# Altium schematic sheet Sheet_1_nizovie.SchDoc
size A4
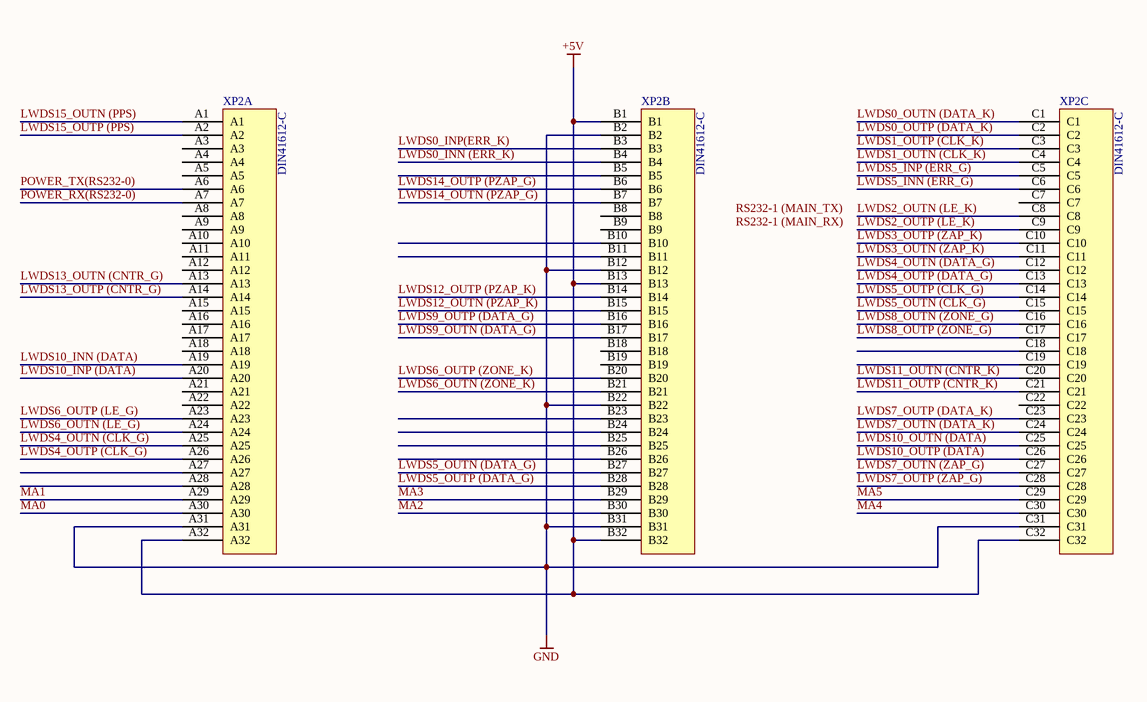
[diagram p0: Sheet_1_nizovie.SchDoc]

## Parts
XP2  DIN41612-C  [DIN41612C]  (parts A,B,C of 3)

## Nets
+5V: XP2.A32 XP2.B1 XP2.B13 XP2.B32 XP2.C32
GND: XP2.A31 XP2.B2 XP2.B12 XP2.B22 XP2.B31 XP2.C31
LWDS0_INN (ERR_K): XP2.B4
LWDS0_INP(ERR_K): XP2.B3
LWDS0_OUTN (DATA_K): XP2.C1
LWDS0_OUTP (DATA_K): XP2.C2
LWDS1_OUTN (CLK_K): XP2.C4
LWDS1_OUTP (CLK_K): XP2.C3
LWDS2_OUTN (LE_K): XP2.C8
LWDS2_OUTP (LE_K): XP2.C9
LWDS3_OUTN (ZAP_K): XP2.C11
LWDS3_OUTP (ZAP_K): XP2.C10
LWDS4_OUTN (CLK_G): XP2.A25
LWDS4_OUTN (DATA_G): XP2.C12
LWDS4_OUTP (CLK_G): XP2.A26
LWDS4_OUTP (DATA_G): XP2.C13
LWDS5_INN (ERR_G): XP2.C6
LWDS5_INP (ERR_G): XP2.C5
LWDS5_OUTN (CLK_G): XP2.C15
LWDS5_OUTN (DATA_G): XP2.B27
LWDS5_OUTP (CLK_G): XP2.C14
LWDS5_OUTP (DATA_G): XP2.B28
LWDS6_OUTN (LE_G): XP2.A24
LWDS6_OUTN (ZONE_K): XP2.B21
LWDS6_OUTP (LE_G): XP2.A23
LWDS6_OUTP (ZONE_K): XP2.B20
LWDS7_OUTN (DATA_K): XP2.C24
LWDS7_OUTN (ZAP_G): XP2.C27
LWDS7_OUTP (DATA_K): XP2.C23
LWDS7_OUTP (ZAP_G): XP2.C28
LWDS8_OUTN (ZONE_G): XP2.C16
LWDS8_OUTP (ZONE_G): XP2.C17
LWDS9_OUTN (DATA_G): XP2.B17
LWDS9_OUTP (DATA_G): XP2.B16
LWDS10_INN (DATA): XP2.A19
LWDS10_INP (DATA): XP2.A20
LWDS10_OUTN (DATA): XP2.C25
LWDS10_OUTP (DATA): XP2.C26
LWDS11_OUTN (CNTR_K): XP2.C20
LWDS11_OUTP (CNTR_K): XP2.C21
LWDS12_OUTN (PZAP_K): XP2.B15
LWDS12_OUTP (PZAP_K): XP2.B14
LWDS13_OUTN (CNTR_G): XP2.A13
LWDS13_OUTP (CNTR_G): XP2.A14
LWDS14_OUTN (PZAP_G): XP2.B7
LWDS14_OUTP (PZAP_G): XP2.B6
LWDS15_OUTN (PPS): XP2.A1
LWDS15_OUTP (PPS): XP2.A2
MA0: XP2.A30
MA1: XP2.A29
MA2: XP2.B30
MA3: XP2.B29
MA4: XP2.C30
MA5: XP2.C29
POWER_RX(RS232-0): XP2.A7
POWER_TX(RS232-0): XP2.A6

Not connected (* = marked no-connect by the designer): XP2 A3 A4 A5 A8 A9 A10 A11 A12 A15 A16 A17 A18 A21 A22 A27 A28 B5 B8 B9 B10 B11 B18 B19 B23 B24 B25 B26 C7 C18 C19 C22

## Notes on the sheet
- Labels drawn without touching a wire or pin: RS232-1 (MAIN_RX), RS232-1 (MAIN_TX)